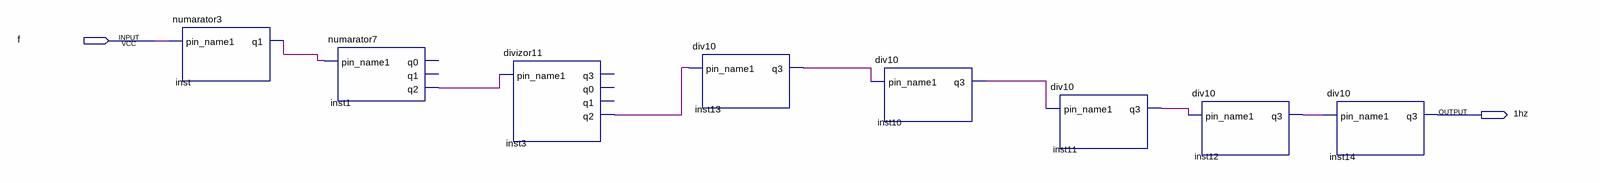
[diagram p0: schematic sheet]
// Quartus schematic divizorfrecventa.bdf as structural Verilog: 8 symbols, 2 pins
module divizorfrecventa (
  input  f,
  output \1hz 
);

  wire inst1_q2, inst3_q2, inst10_q3, inst11_q3, inst12_q3, inst13_q3, inst_q1;

  numarator3 inst (.pin_name1(f), .q1(inst_q1));
  numarator7 inst1 (.pin_name1(inst_q1), .q2(inst1_q2));  // open: q0, q1
  divizor11 inst3 (.pin_name1(inst1_q2), .q2(inst3_q2));  // open: q3, q0, q1
  div10 inst13 (.pin_name1(inst3_q2), .q3(inst13_q3));
  div10 inst10 (.pin_name1(inst13_q3), .q3(inst10_q3));
  div10 inst11 (.pin_name1(inst10_q3), .q3(inst11_q3));
  div10 inst12 (.pin_name1(inst11_q3), .q3(inst12_q3));
  div10 inst14 (.pin_name1(inst12_q3), .q3(\1hz ));
endmodule
